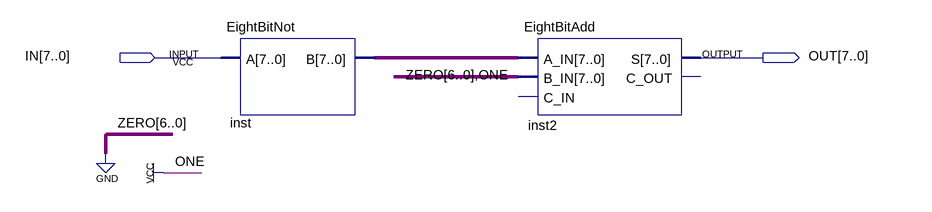
[diagram p0: schematic sheet]
// Quartus schematic EightBitInv.bdf as structural Verilog: 2 symbols, 2 pins
module EightBitInv (
  input  [7:0] IN,
  output [7:0] OUT
);

  wire [7:0] inst_b;

  EightBitNot inst (.A(IN), .B(inst_b));
  EightBitAdd inst2 (.A_IN(inst_b), .B_IN(8'b00000001), .S(OUT));  // open: C_IN, C_OUT
endmodule
